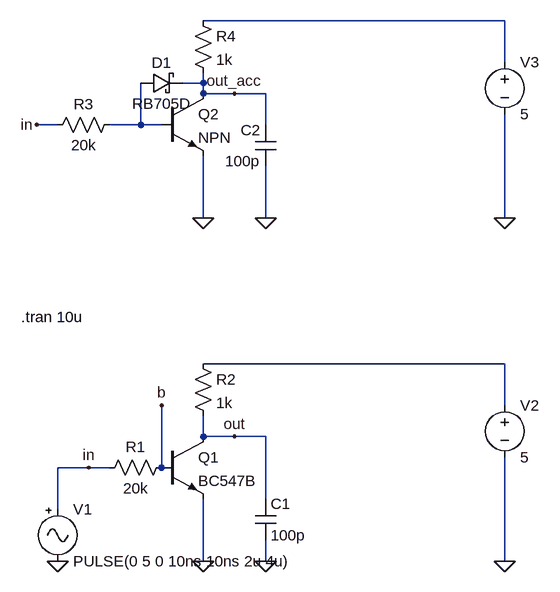
[diagram p0: schematic Draft4.asc]
Draft4.asc, the LTspice schematic file:
Version 4
SHEET 1 880 824
WIRE 608 -32 144 -32
WIRE 608 32 608 -32
WIRE 144 64 144 48
WIRE 144 64 112 64
WIRE 144 80 144 64
WIRE 192 80 144 80
WIRE 240 80 192 80
WIRE -80 128 -112 128
WIRE 48 128 48 64
WIRE 48 128 0 128
WIRE 80 128 48 128
WIRE 240 128 240 80
WIRE 144 272 144 176
WIRE 240 272 240 192
WIRE 608 272 608 112
WIRE 608 496 144 496
WIRE 608 560 608 496
WIRE 144 608 144 576
WIRE 192 608 144 608
WIRE 240 608 192 608
WIRE -32 656 -80 656
WIRE 0 656 -32 656
WIRE 80 656 80 560
WIRE 240 704 240 608
WIRE -80 720 -80 656
WIRE 144 800 144 704
WIRE 240 800 240 768
WIRE 608 800 608 640
FLAG 144 272 0
FLAG 240 272 0
FLAG 608 272 0
FLAG -112 128 in
FLAG 192 80 out_acc
FLAG -80 800 0
FLAG 144 800 0
FLAG 240 800 0
FLAG 608 800 0
FLAG -32 656 in
FLAG 192 608 out
FLAG 80 560 b
SYMBOL res 16 112 R90
WINDOW 0 0 56 VBottom 2
WINDOW 3 32 56 VTop 2
SYMATTR InstName R3
SYMATTR Value 20k
SYMBOL res 128 -48 R0
SYMATTR InstName R4
SYMATTR Value 1k
SYMBOL voltage 608 16 R0
WINDOW 123 0 0 Left 0
WINDOW 39 0 0 Left 0
SYMATTR InstName V3
SYMATTR Value 5
SYMBOL cap 256 192 R180
WINDOW 0 24 56 Left 2
WINDOW 3 24 8 Left 2
SYMATTR InstName C2
SYMATTR Value 100p
SYMBOL npn 80 80 R0
SYMATTR InstName Q2
SYMBOL schottky 48 80 R270
WINDOW 0 32 32 VTop 2
WINDOW 3 0 32 VBottom 2
SYMATTR InstName D1
SYMATTR Value RB705D
SYMBOL Misc\\signal -80 704 R0
WINDOW 123 0 0 Left 0
WINDOW 39 0 0 Left 0
SYMATTR InstName V1
SYMATTR Value PULSE(0 5 0 10ns 10ns 2u 4u)
SYMBOL res 96 640 R90
WINDOW 0 0 56 VBottom 2
WINDOW 3 32 56 VTop 2
SYMATTR InstName R1
SYMATTR Value 20k
SYMBOL res 128 480 R0
SYMATTR InstName R2
SYMATTR Value 1k
SYMBOL voltage 608 544 R0
WINDOW 123 0 0 Left 0
WINDOW 39 0 0 Left 0
SYMATTR InstName V2
SYMATTR Value 5
SYMBOL cap 224 704 R0
SYMATTR InstName C1
SYMATTR Value 100p
SYMBOL npn 80 608 R0
SYMATTR InstName Q1
SYMATTR Value BC547B
TEXT -136 424 Left 2 !.tran 10u

The netlist it stands for:
* Draft4.asc
R3 N002 in 20k
R4 N001 out_acc 1k
V3 N001 0 5
C2 0 out_acc 100p
Q2 out_acc N002 0 0 NPN
D1 N002 out_acc RB705D
V1 in 0 PULSE(0 5 0 10ns 10ns 2u 4u)
R1 b in 20k
R2 N003 out 1k
V2 N003 0 5
C1 out 0 100p
Q1 out b 0 0 BC547B
.model D D
.lib standard.dio
.model NPN NPN
.model PNP PNP
.lib standard.bjt
.tran 10u
.backanno
.end